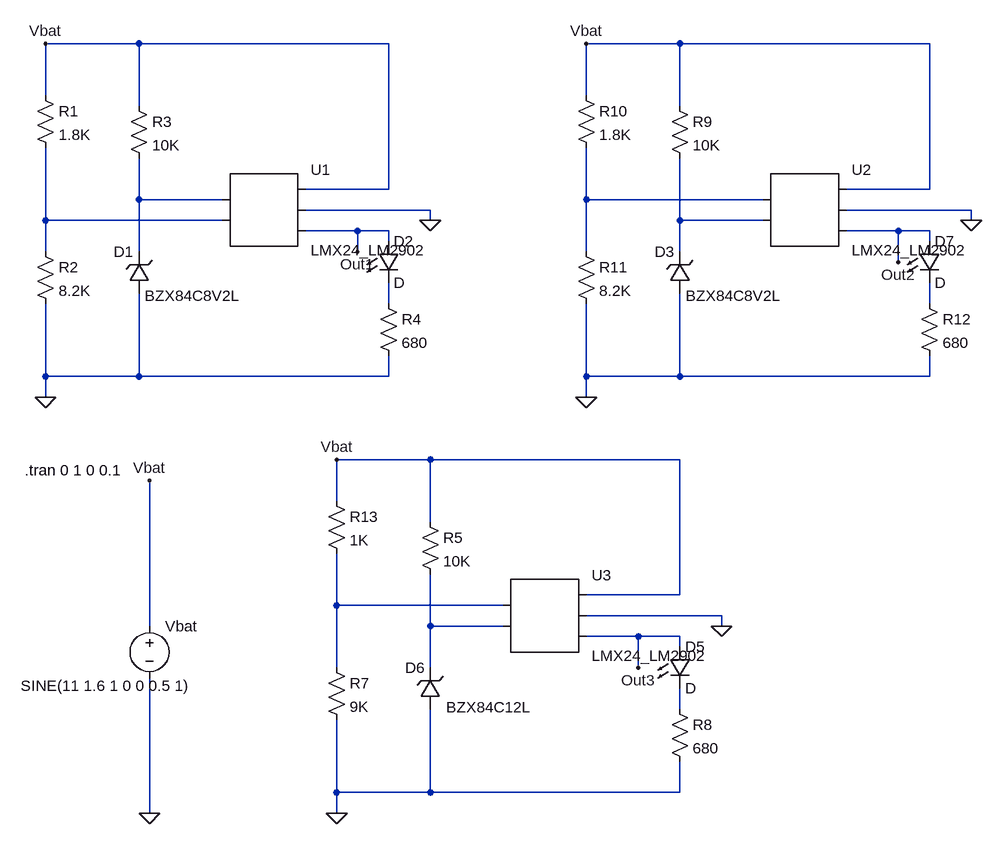
[diagram p0: schematic Battery_Voltage_Measurement.asc]
* Battery_Voltage_Measurement.asc
R3 Vbat N001 10K
Vbat Vbat 0 SINE(11 1.6 1 0 0 0.5 1)
D1 0 N001 BZX84C8V2L
R1 Vbat N003 1.8K
R2 N003 0 8.2K
D2 Out1 N005 D
R4 N005 0 680
R5 Vbat N008 10K
R7 N007 0 9K
D5 Out3 N009 D
R8 N009 0 680
D6 0 N008 BZX84C12L
R9 Vbat N004 10K
D3 0 N004 BZX84C8V2L
R10 Vbat N002 1.8K
R11 N002 0 8.2K
D7 Out2 N006 D
R12 N006 0 680
R13 Vbat N007 1K
* U1: LMX24_LM2902 (symbol AutoGenerated\LMX24_LM2902 not available, pins judged from their places): pin1=N001 pin2=N003 pin3=Vbat pin4=0 pin5=Out1
* U2: LMX24_LM2902 (symbol AutoGenerated\LMX24_LM2902 not available, pins judged from their places): pin1=N002 pin2=N004 pin3=Vbat pin4=0 pin5=Out2
* U3: LMX24_LM2902 (symbol AutoGenerated\LMX24_LM2902 not available, pins judged from their places): pin1=N007 pin2=N008 pin3=Vbat pin4=0 pin5=Out3
.model D D
.lib standard.dio
.tran 0 1 0 0.1
.backanno
.end

* Results of the author's LTspice run, read from the files saved beside the schematic
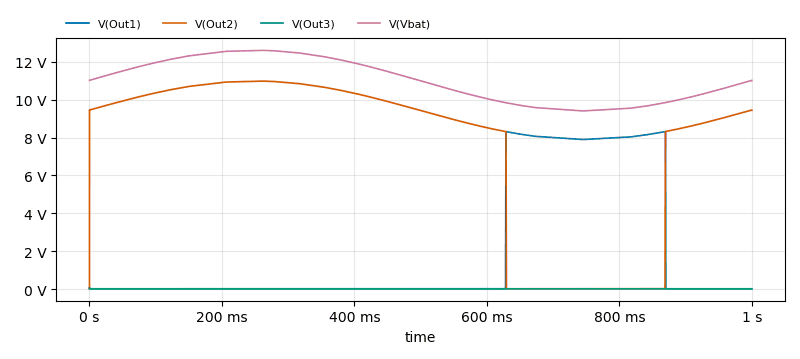
[diagram p1: Transient Analysis of Battery_Voltage_Measurement.asc, plotted from the saved traces]
* Transient Analysis, 1 run:
*   V(Out1): min 23.78 mV, max 8.315 V, average 1.962 V, rms 3.955 V, last 23.79 mV
*   V(Out2): min 23.78 mV, max 10.97 V, average 7.51 V, rms 8.64 V, last 9.435 V
*   V(Out3): min 23.79 mV, max 49.84 mV, average 23.79 mV, rms 23.79 mV, last 23.79 mV
*   V(Vbat): min 9.401 V, max 12.59 V, average 11 V, rms 11.06 V, last 11 V